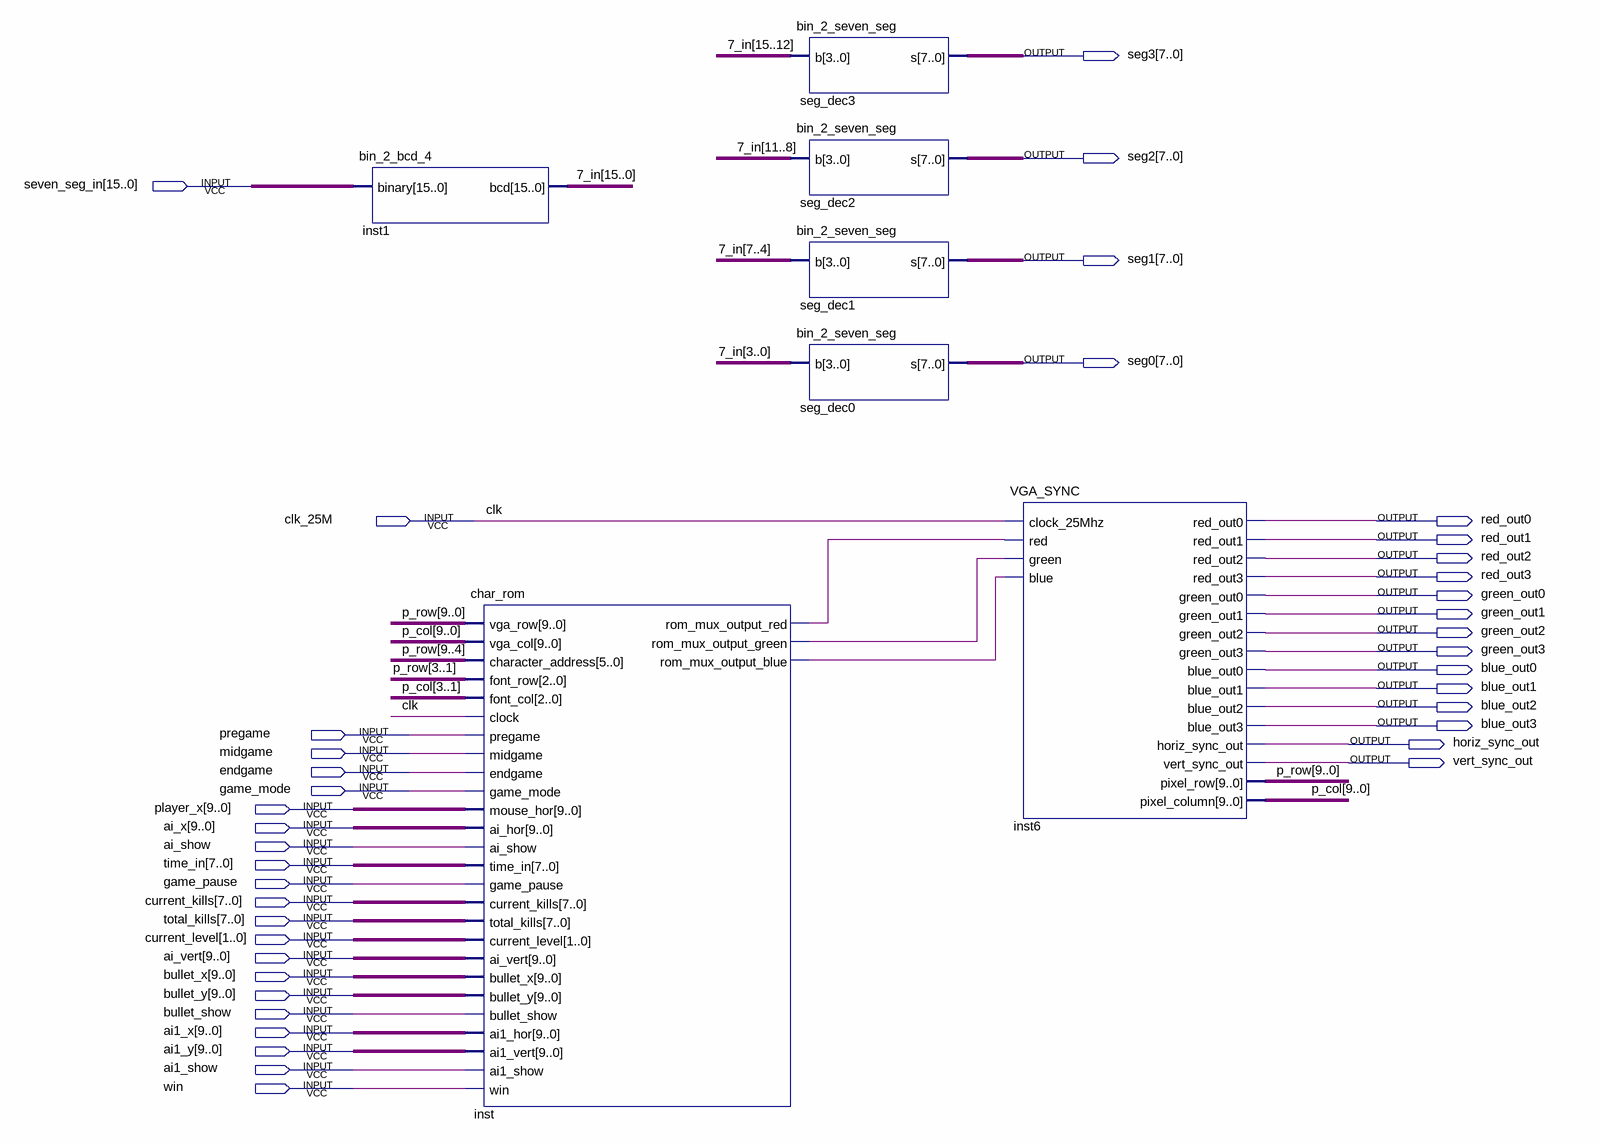
[diagram p0: schematic sheet]
// Quartus schematic output.bdf as structural Verilog: 7 symbols, 40 pins
module \output  (
  input  [15:0] seven_seg_in,
  input  clk_25M,
  input  pregame,
  input  midgame,
  input  endgame,
  input  game_mode,
  input  [9:0] player_x,
  input  [9:0] ai_x,
  input  ai_show,
  input  [7:0] time_in,
  input  game_pause,
  input  [7:0] current_kills,
  input  [7:0] total_kills,
  input  [1:0] current_level,
  input  [9:0] ai_vert,
  input  [9:0] bullet_x,
  input  [9:0] bullet_y,
  input  bullet_show,
  input  [9:0] ai1_x,
  input  [9:0] ai1_y,
  input  ai1_show,
  input  win,
  output [7:0] seg3,
  output [7:0] seg2,
  output [7:0] seg1,
  output [7:0] seg0,
  output red_out0,
  output red_out1,
  output red_out2,
  output red_out3,
  output green_out0,
  output green_out1,
  output green_out2,
  output green_out3,
  output blue_out0,
  output blue_out1,
  output blue_out2,
  output blue_out3,
  output horiz_sync_out,
  output vert_sync_out
);

  wire inst_rom_mux_output_blue, inst_rom_mux_output_green, inst_rom_mux_output_red;
  wire [9:0] p_col, p_row;
  wire [15:0] \7_in ;

  bin_2_bcd_4 inst1 (.binary(seven_seg_in), .bcd(\7_in ));
  char_rom inst (
    .vga_row(p_row), .vga_col(p_col), .character_address(p_row[9:4]), .font_row(p_row[3:1]),
    .font_col(p_col[3:1]), .clock(clk_25M), .pregame(pregame), .midgame(midgame), .endgame(endgame),
    .game_mode(game_mode), .mouse_hor(player_x), .ai_hor(ai_x), .ai_show(ai_show), .time_in(time_in),
    .game_pause(game_pause), .current_kills(current_kills), .total_kills(total_kills),
    .current_level(current_level), .ai_vert(ai_vert), .bullet_x(bullet_x), .bullet_y(bullet_y),
    .bullet_show(bullet_show), .ai1_hor(ai1_x), .ai1_vert(ai1_y), .ai1_show(ai1_show), .win(win),
    .rom_mux_output_red(inst_rom_mux_output_red), .rom_mux_output_green(inst_rom_mux_output_green),
    .rom_mux_output_blue(inst_rom_mux_output_blue));
  bin_2_seven_seg seg_dec3 (.b(\7_in [15:12]), .s(seg3));
  bin_2_seven_seg seg_dec2 (.b(\7_in [11:8]), .s(seg2));
  bin_2_seven_seg seg_dec1 (.b(\7_in [7:4]), .s(seg1));
  bin_2_seven_seg seg_dec0 (.b(\7_in [3:0]), .s(seg0));
  VGA_SYNC inst6 (
    .clock_25Mhz(clk_25M), .red(inst_rom_mux_output_red), .green(inst_rom_mux_output_green),
    .blue(inst_rom_mux_output_blue), .red_out0(red_out0), .red_out1(red_out1), .red_out2(red_out2),
    .red_out3(red_out3), .green_out0(green_out0), .green_out1(green_out1), .green_out2(green_out2),
    .green_out3(green_out3), .blue_out0(blue_out0), .blue_out1(blue_out1), .blue_out2(blue_out2),
    .blue_out3(blue_out3), .horiz_sync_out(horiz_sync_out), .vert_sync_out(vert_sync_out), .pixel_row(p_row),
    .pixel_column(p_col));

  // Other names for the same wires on the sheet: clk = clk_25M
endmodule
